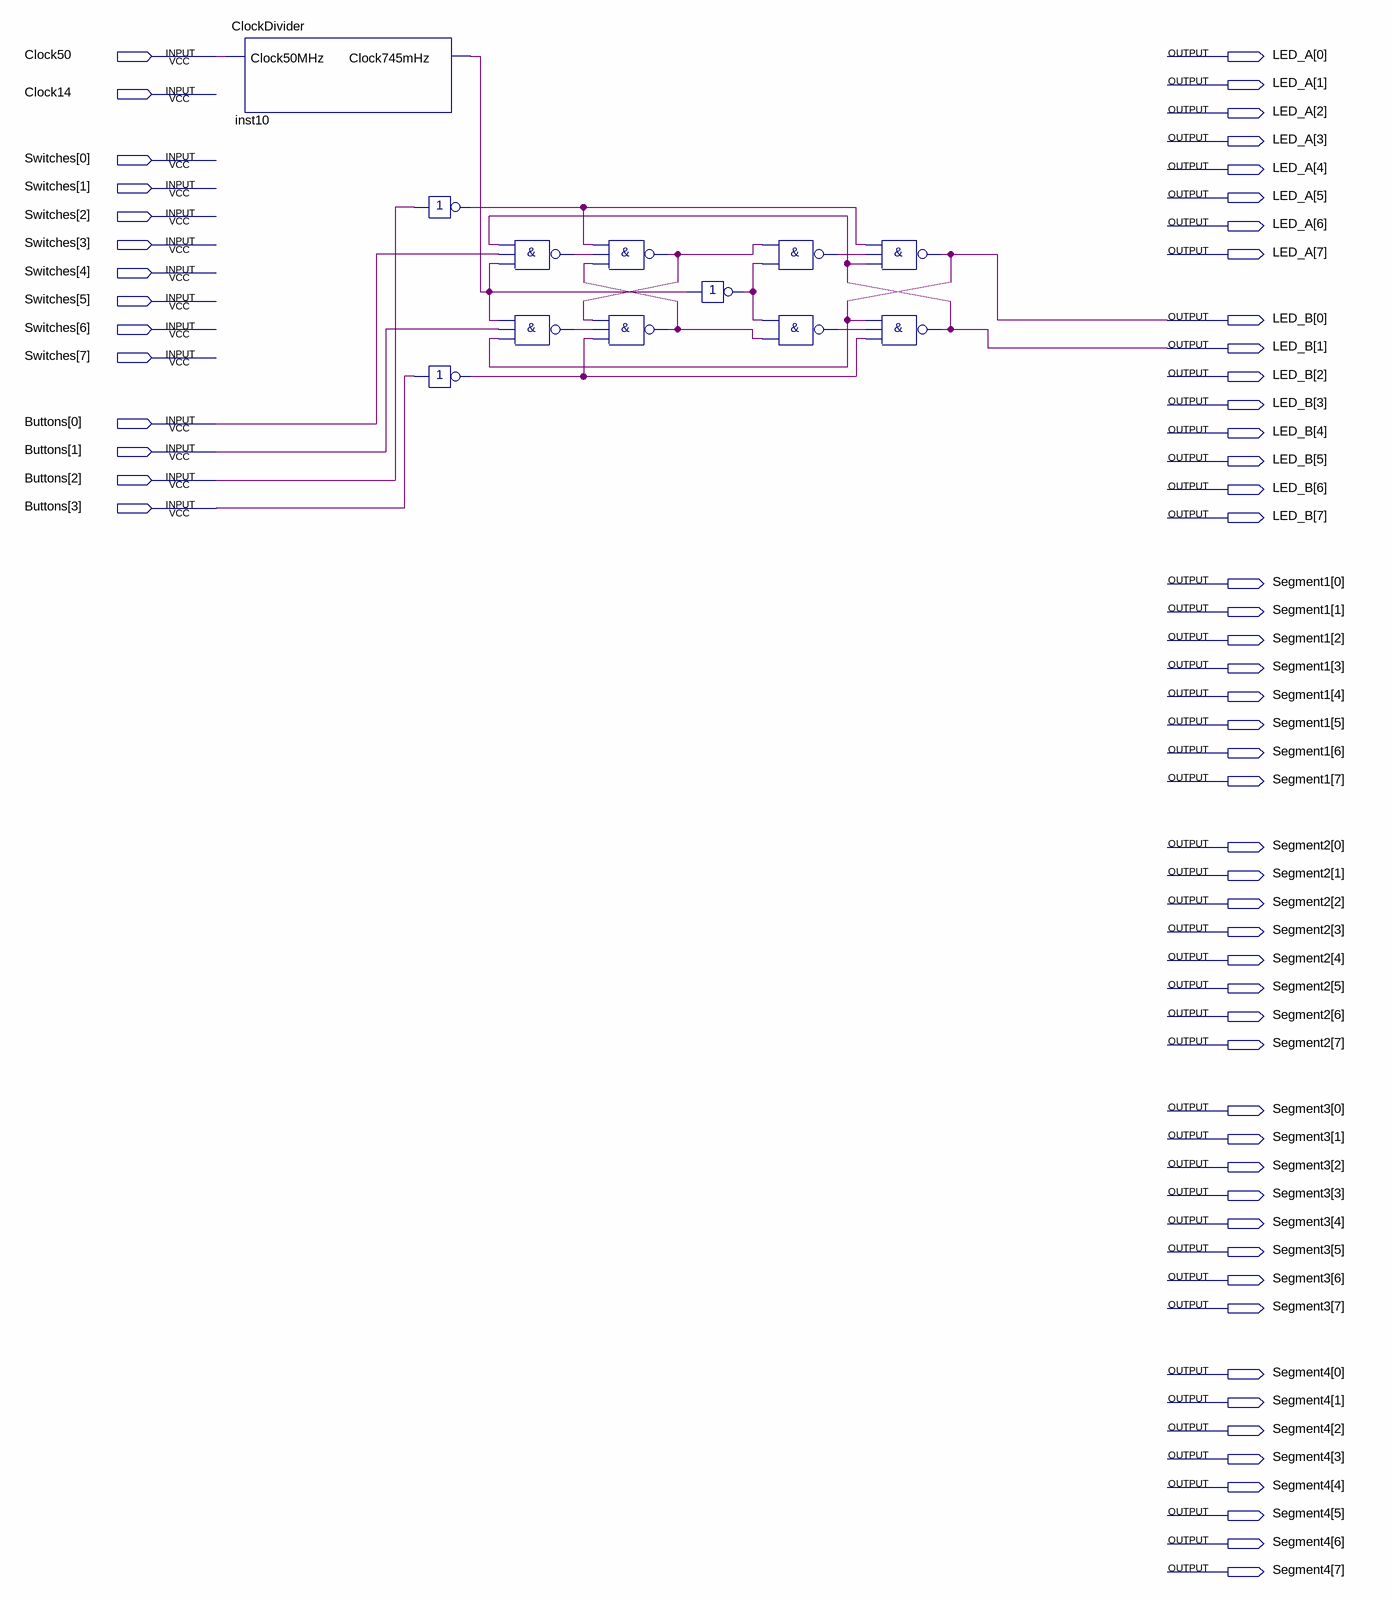
[diagram p0: schematic sheet]
// Quartus schematic JKMSFlipFlop.bdf as structural Verilog: 12 symbols, 62 pins
module JKMSFlipFlop (
  input  Clock50,
  input  Clock14,
  input  [7:0] Switches,
  input  [3:0] Buttons,
  output [7:0] LED_A,
  output [7:0] LED_B,
  output [7:0] Segment1,
  output [7:0] Segment2,
  output [7:0] Segment3,
  output [7:0] Segment4
);

  wire inst6_out, inst10_clock745mhz, inst13_out, inst18_out, inst19_out, inst20_out, inst23_out,
       inst23_out_2, inst24_out, inst25_out;

  ClockDivider inst10 (.Clock50MHz(Clock50), .Clock745mHz(inst10_clock745mhz));
  not inst19 (inst19_out, Buttons[2]);
  not inst18 (inst18_out, Buttons[3]);
  nand inst23 (inst23_out_2, LED_B[1], Buttons[0], inst10_clock745mhz);
  nand inst24 (inst24_out, inst10_clock745mhz, Buttons[1], LED_B[0]);
  nand inst23_dup2 (inst23_out, inst19_out, inst23_out_2, inst25_out);
  nand inst25 (inst25_out, inst23_out, inst24_out, inst18_out);
  not inst20 (inst20_out, inst10_clock745mhz);
  nand inst6 (inst6_out, inst23_out, inst20_out);
  nand inst13 (inst13_out, inst20_out, inst25_out);
  nand inst22 (LED_B[0], inst19_out, inst6_out, LED_B[1]);
  nand inst26 (LED_B[1], LED_B[0], inst13_out, inst18_out);
endmodule
